# EAGLE schematic mySensors (EAGLE 7.6.0)
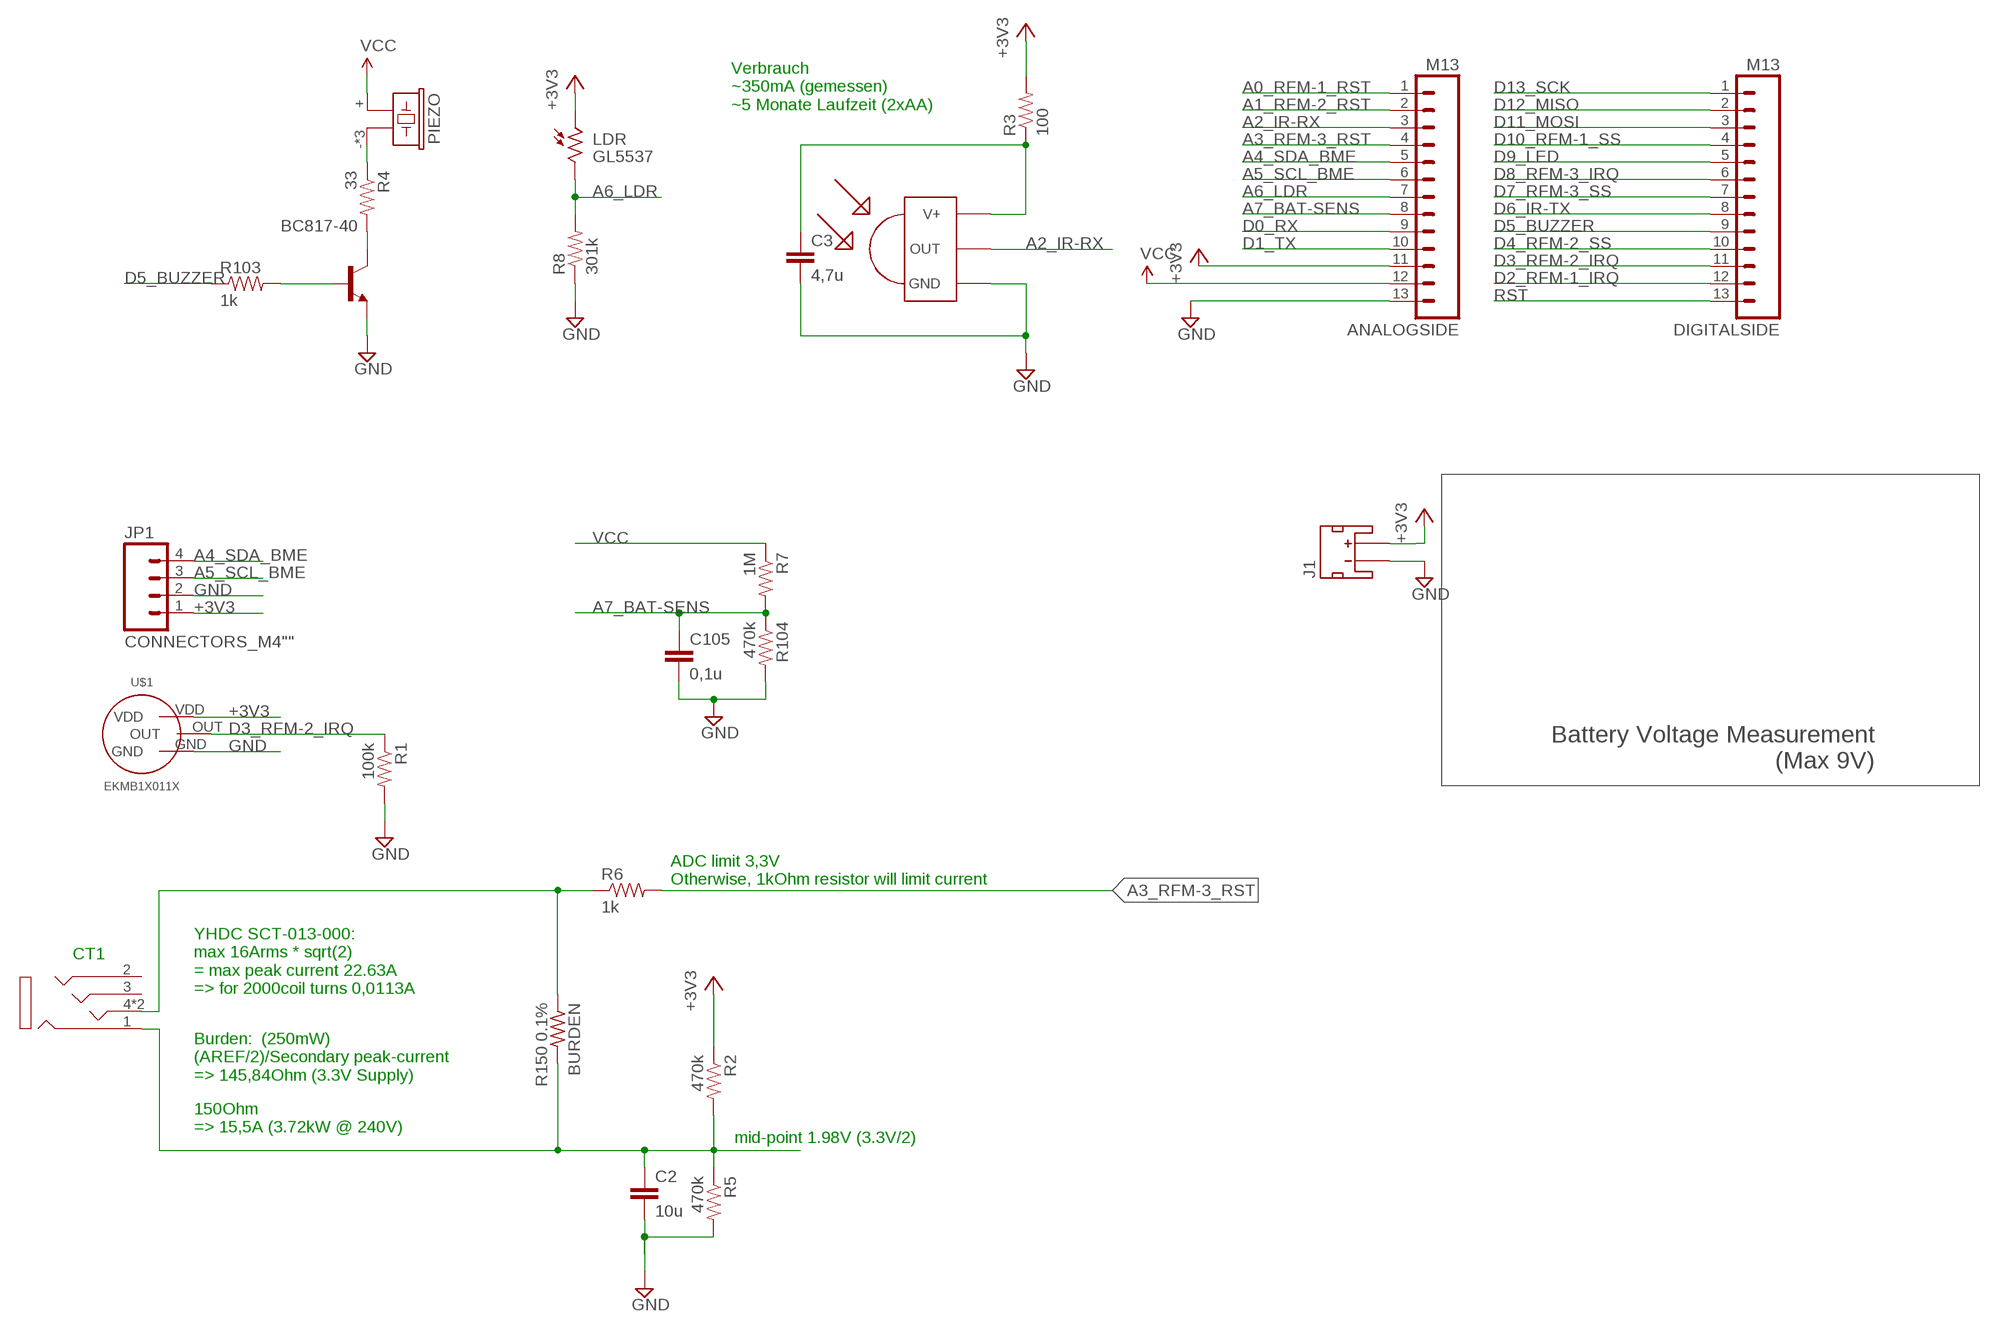
[diagram p0: schematic, sheet 1]

## Parts
ANALOGSIDE  M13  [1X13]
BC817-40  BC817-40-NPN-SOT23-BEC  [SOT23-BEC]
BURDEN  R150 0.1%  R-US_R0805  [R0805]
C2  10u  CAP0805-CAP  [0805-CAP]
C3  4,7u  CAP0805-CAP  [0805-CAP]
C105  0,1u  CAP0603-CAP  [0603-CAP]
CT1  1503_13  [1503-03]
DIGITALSIDE  M13  [1X13]
IR-RX  TSOP4836  [TSOP18XX]
J1  JST_2MM_MALE  [JST-2-SMD]
JP1  CONNECTORS_M4""  [CONNECTORS_1X4]
LDR  GL5537  M9960_11A  [M9960]
PIEZO  BUZZER-PIEZO_SMD  [BUZZER-PIEZO_SMD]
R1  100k  RESISTOR0603-RES  [0603-RES]
R2  470k  RESISTOR0603-RES  [0603-RES]
R3  100  RESISTOR0603-RES  [0603-RES]
R4  33  RESISTOR0603-RES  [0603-RES]
R5  470k  RESISTOR0603-RES  [0603-RES]
R6  1k  RESISTOR0603-RES  [0603-RES]
R7  1M  RESISTOR0603-RES  [0603-RES]
R8  301k  RESISTOR0603-RES  [0603-RES]
R103  1k  RESISTOR0603-RES  [0603-RES]
R104  470k  RESISTOR0603-RES  [0603-RES]
U$1  EKMB1X011X  [PIR-PANASONIC-VZ-WL-STANDARD]

## Nets
+3V3 [power]: ANALOGSIDE.11 J1.2(+) JP1.1 LDR.1 R2.1 R3.2 U$1.VDD
A0_RFM-1_RST: ANALOGSIDE.1
A1_RFM-2_RST: ANALOGSIDE.2
A2_IR-RX: ANALOGSIDE.3 IR-RX.OUT
A3_RFM-3_RST: ANALOGSIDE.4 R6.2
A4_SDA_BME: ANALOGSIDE.5 JP1.4
A5_SCL_BME: ANALOGSIDE.6 JP1.3
A6_LDR: ANALOGSIDE.7 LDR.2 R8.2
A7_BAT-SENS [power]: ANALOGSIDE.8 C105.1 R7.2 R104.1
D0_RX: ANALOGSIDE.9
D1_TX: ANALOGSIDE.10
D2_RFM-1_IRQ: DIGITALSIDE.12
D3_RFM-2_IRQ: DIGITALSIDE.11 R1.1 U$1.OUT
D4_RFM-2_SS: DIGITALSIDE.10
D5_BUZZER: DIGITALSIDE.9 R103.1
D6_IR-TX: DIGITALSIDE.8
D7_RFM-3_SS: DIGITALSIDE.7
D8_RFM-3_IRQ: DIGITALSIDE.6
D9_LED: DIGITALSIDE.5
D10_RFM-1_SS: DIGITALSIDE.4
D11_MOSI: DIGITALSIDE.3
D12_MISO: DIGITALSIDE.2
D13_SCK: DIGITALSIDE.1
GND [power]: ANALOGSIDE.13 BC817-40.E C2.2 C3.2 C105.2 IR-RX.GND J1.1(-) JP1.2 R1.2 R5.2 R8.1 R104.2 U$1.GND
N$1: BURDEN.2 C2.1 CT1.1 R2.2 R5.1
N$3: BURDEN.1 CT1.4 CT1.4-2 R6.1
N$5: PIEZO.- PIEZO.DUMMY PIEZO.DUMMY1 R4.1
N$8: BC817-40.C R4.2
N$15: BC817-40.B R103.2
N$16: C3.1 IR-RX.VCC(V+) R3.1
RST: DIGITALSIDE.13
VCC [power]: ANALOGSIDE.12 PIEZO.+ R7.1
Unconnected: CT1.2 CT1.3 J1.NC1(PAD1) J1.NC2(PAD2)

## Notes on the sheet
- Verbrauch 
  ~350mA (gemessen)
  ~5 Monate Laufzeit (2xAA)
- Battery Voltage Measurement
  (Max 9V)
- ADC limit 3,3V
  Otherwise, 1kOhm resistor will limit current
- CT1
- YHDC SCT-013-000: 
  max 16Arms * sqrt(2)
  = max peak current 22.63A
  => for 2000coil turns 0,0113A
- Burden:  (250mW)
  (AREF/2)/Secondary peak-current
  => 145,84Ohm (3.3V Supply)
- 150Ohm 
  => 15,5A (3.72kW @ 240V)
- mid-point 1.98V (3.3V/2)

## Library data of the parts
ANALOGSIDE DIGITALSIDE = SparkFun-Connectors:M13: 13-pin single row .1" header; BUERKLIN: 59 F 2140
BC817-40 = myLib:*-NPN-: NPN Transistror BF959 corrected 2008.03.06; BUERKLIN: 12S6220
BURDEN = resistor:R-US_: RESISTOR, American symbol; BUERKLIN: 28 E 114
C2 = LowPowerLab:CAP: Capacitor Standard 0603 ceramic capacitor, and 0.1" leaded capacitor.; BUERKLIN: 53 D 2432
C3 = LowPowerLab:CAP: Capacitor Standard 0603 ceramic capacitor, and 0.1" leaded capacitor.; BUERKLIN: 53 D 2431
C105 = LowPowerLab:CAP: Capacitor Standard 0603 ceramic capacitor, and 0.1" leaded capacitor.; BUERKLIN: 53 D 1726
CT1 = myLib:1503_13; BUERKLIN: 39F1215
IR-RX = myLib:TSOP4836: IR Receiver and Demodulator; CONRAD: 171107-62; EBAY: TSOP34836
J1 = myLib:JST_2MM_MALE: Mates to single-cell LiPo batteries. CONN-08352; BUERKLIN: 71 F 5386; CONRAD: 1217299 - 62; PROD_ID: S2B-PH-SM4-TB
JP1 = myLib:CONNECTORS_M4: 13-pin single row .1" header
LDR = photo-elements:M9960_11: Photo Sensor Beacon Light, Photometer Applications Source: http://optoelectronics.perkinelmer.com/content/Datasheets/DTS_M9960.pdf; EBAY: GL5537
PIEZO = myLib:BUZZER-PIEZO_SMD: Piezoelectric Acoustic Transducer; BUERKLIN: 36 M 370; BUERKLIN_3V: 36 M 346
R1 = LowPowerLab:RESISTOR: Resistor Basic schematic elements and footprints for 0603, 1206, and PTH resistors.; BUERKLIN: 26 E 840
R2 R5 R104 = LowPowerLab:RESISTOR: Resistor Basic schematic elements and footprints for 0603, 1206, and PTH resistors.; BUERKLIN: 26 E 856
R3 = LowPowerLab:RESISTOR: Resistor Basic schematic elements and footprints for 0603, 1206, and PTH resistors.; BUERKLIN: 26 E 768
R4 = LowPowerLab:RESISTOR: Resistor Basic schematic elements and footprints for 0603, 1206, and PTH resistors.; BUERKLIN: 26 E 756
R6 R103 = LowPowerLab:RESISTOR: Resistor Basic schematic elements and footprints for 0603, 1206, and PTH resistors.; BUERKLIN: 26 E 792
R7 = LowPowerLab:RESISTOR: Resistor Basic schematic elements and footprints for 0603, 1206, and PTH resistors.; BUERKLIN: 26 E 864
R8 = LowPowerLab:RESISTOR: Resistor Basic schematic elements and footprints for 0603, 1206, and PTH resistors.; BUERKLIN: 26 E 7197
U$1 = myLib:EKMB1X011X; DIGIKEY: 255-3065-ND

## Net classes
0 default: width 0.381 mm, clearance 0.254 mm
1 power: width 0.508 mm, clearance 0.254 mm